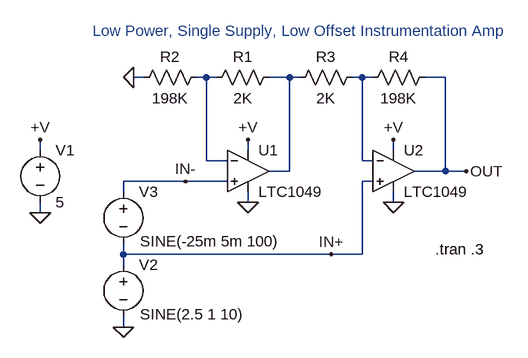
[diagram p0: schematic 1049.asc]
1049.asc, the LTspice schematic file:
Version 4
SHEET 1 896 680
WIRE 32 96 16 96
WIRE 128 96 112 96
WIRE 144 96 128 96
WIRE 256 96 224 96
WIRE 272 96 256 96
WIRE 368 96 352 96
WIRE 384 96 368 96
WIRE 496 96 464 96
WIRE -128 208 -128 192
WIRE 192 208 192 192
WIRE 416 208 416 192
WIRE 128 224 128 96
WIRE 160 224 128 224
WIRE 368 224 368 96
WIRE 384 224 368 224
WIRE 256 240 256 96
WIRE 256 240 224 240
WIRE 496 240 496 96
WIRE 496 240 448 240
WIRE 528 240 496 240
WIRE 96 256 0 256
WIRE 160 256 96 256
WIRE 384 256 368 256
WIRE 0 272 0 256
WIRE 192 288 192 272
WIRE 416 288 416 272
WIRE -128 304 -128 288
WIRE 0 368 0 352
WIRE 320 368 0 368
WIRE 368 368 368 256
WIRE 368 368 320 368
WIRE 0 384 0 368
WIRE 0 480 0 464
FLAG -128 304 0
FLAG 192 192 +V
FLAG -128 192 +V
FLAG 16 96 0
FLAG 192 288 0
FLAG 416 192 +V
FLAG 416 288 0
FLAG 0 480 0
FLAG 528 240 OUT
FLAG 96 256 IN-
FLAG 320 368 IN+
SYMBOL voltage -128 192 R0
SYMATTR InstName V1
SYMATTR Value 5
SYMBOL res 240 80 R90
WINDOW 0 0 56 VBottom 0
WINDOW 3 32 56 VTop 0
SYMATTR InstName R1
SYMATTR Value 2K
SYMBOL res 128 80 R90
WINDOW 0 0 56 VBottom 0
WINDOW 3 32 56 VTop 0
SYMATTR InstName R2
SYMATTR Value 198K
SYMBOL voltage 0 256 R0
WINDOW 3 26 92 Left 0
SYMATTR Value SINE(-25m 5m 100)
SYMATTR InstName V3
SYMBOL opamps\\LTC1049 192 176 R0
SYMATTR InstName U1
SYMBOL res 368 80 R90
WINDOW 0 0 56 VBottom 0
WINDOW 3 32 56 VTop 0
SYMATTR InstName R3
SYMATTR Value 2K
SYMBOL res 480 80 R90
WINDOW 0 0 56 VBottom 0
WINDOW 3 32 56 VTop 0
SYMATTR InstName R4
SYMATTR Value 198K
SYMBOL opamps\\LTC1049 416 176 R0
SYMATTR InstName U2
SYMBOL voltage 0 368 R0
WINDOW 3 26 92 Left 0
SYMATTR Value SINE(2.5 1 10)
SYMATTR InstName V2
TEXT 480 360 Left 0 !.tran .3
TEXT 272 40 Bottom 0 ;Low Power, Single Supply, Low Offset Instrumentation Amp

The netlist it stands for:
* 1049.asc
V1 +V 0 5
R1 N002 N001 2K
R2 N001 0 198K
V3 IN- IN+ SINE(-25m 5m 100)
XU1 IN- N001 +V 0 N002 LTC1049  ; pins In+ In- V+ V- OUT
R3 N003 N002 2K
R4 OUT N003 198K
XU2 IN+ N003 +V 0 OUT LTC1049  ; pins In+ In- V+ V- OUT
V2 IN+ 0 SINE(2.5 1 10)
.tran .3
* Low Power, Single Supply, Low Offset Instrumentation Amp
.backanno
.end